# Altium schematic sheet AT long bus (13.3 x 4.2 inches).schdoc: AT long bus (13.3 x 4.2 inches)
size A; Organization: Organization; Address1: Address1; Address2: Address2; Address3: Address3; Address4: Address4; DocumentNumber: 1; Revision: 0; SheetNumber: 2; SheetTotal: 2
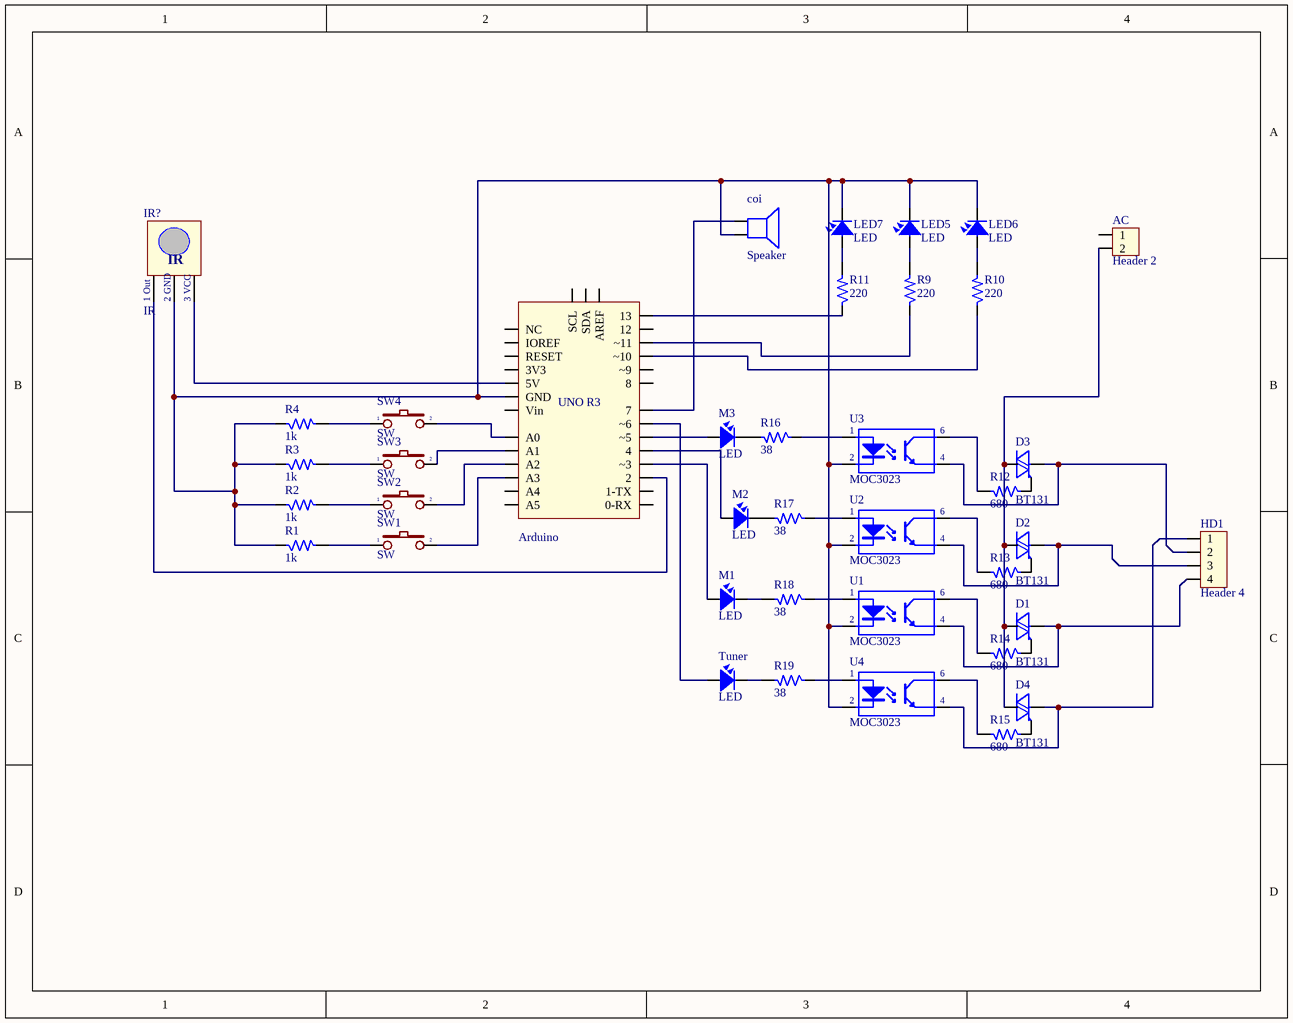
[diagram p0: AT long bus (13.3 x 4.2 inches).schdoc]

## Parts
AC  Header 2  [HED2]
Arduino  Arduino Uno R3  [Arduino UNO R3]  (value not drawn)
coi  Speaker  [SPEAKER]
D1  BT131  [TO92127P520H787-3]
D2  BT131  [TO92127P520H787-3]
D3  BT131  [TO92127P520H787-3]
D4  BT131  [TO92127P520H787-3]
HD1  Header 4  [HED4]
IR?  IR  [IR]
LED5  LED  [LED-5TRED]
LED6  LED  [LED-5TRED]
LED7  LED  [LED-5TRED]
M1  LED  [LED-5TRED]
M2  LED  [LED-5TRED]
M3  LED  [LED-5TRED]
R1  1k  [R1/8W]
R2  1k  [R1/8W]
R3  1k  [R1/8W]
R4  1k  [R1/8W]
R9  220  [R1/8W]
R10  220  [R1/8W]
R11  220  [R1/8W]
R12  680  [R1/8W]
R13  680  [R1/8W]
R14  680  [R1/8W]
R15  680  [R1/8W]
R16  38  [R1/8W]
R17  38  [R1/8W]
R18  38  [R1/8W]
R19  38  [R1/8W]
SW1  SW  [SW2]
SW2  SW  [SW2]
SW3  SW  [SW2]
SW4  SW  [SW2]
Tuner  LED  [LED-5TRED]
U1  MOC3023  [DIP6]
U2  MOC3023  [DIP6]
U3  MOC3023  [DIP6]
U4  MOC3023  [DIP6]

## Nets
NetAC_2: AC.2 D1.3(MT2) D2.3(MT2) D3.3(MT2) D4.3(MT2)
NetArduino_2: Arduino.2 IR?.1(Out)
NetArduino_4: Arduino.4 M2.1
NetArduino_5V: Arduino.5V IR?.3(VCC)
NetArduino_7: Arduino.7 coi.1
NetArduino_13: Arduino.13 R11.1
NetArduino_A0: Arduino.A0 SW4.2
NetArduino_A1: Arduino.A1 SW3.2
NetArduino_A2: Arduino.A2 SW2.2
NetArduino_A3: Arduino.A3 SW1.2
NetArduino_GND: Arduino.GND coi.2 IR?.2(GND) LED5.2 LED6.2 LED7.2 R1.1 R2.1 R3.1 R4.1 U1.2(K) U2.2(K) U3.2(K) U4.2(K)
NetArduino_~3: Arduino.~3 M1.1
NetArduino_~5: Arduino.~5 M3.1
NetArduino_~6: Arduino.~6 Tuner.1
NetArduino_~10: Arduino.~10 R10.1
NetArduino_~11: Arduino.~11 R9.1
NetD1_1: D1.1(MT1) HD1.4 U1.4(E)
NetD1_2: D1.2(G) R14.1
NetD2_1: D2.1(MT1) HD1.3 U2.4(E)
NetD2_2: D2.2(G) R13.1
NetD3_1: D3.1(MT1) HD1.2 U3.4(E)
NetD3_2: D3.2(G) R12.1
NetD4_1: D4.1(MT1) HD1.1 U4.4(E)
NetD4_2: D4.2(G) R15.1
NetLED5_1: LED5.1 R9.2
NetLED6_1: LED6.1 R10.2
NetLED7_1: LED7.1 R11.2
NetM1_2: M1.2 R18.2
NetM2_2: M2.2 R17.2
NetM3_2: M3.2 R16.2
NetR1_2: R1.2 SW1.1
NetR2_2: R2.2 SW2.1
NetR3_2: R3.2 SW3.1
NetR4_2: R4.2 SW4.1
NetR12_2: R12.2 U3.6(C)
NetR13_2: R13.2 U2.6(C)
NetR14_2: R14.2 U1.6(C)
NetR15_2: R15.2 U4.6(C)
NetR16_1: R16.1 U3.1(A)
NetR17_1: R17.1 U2.1(A)
NetR18_1: R18.1 U1.1(A)
NetR19_1: R19.1 U4.1(A)
NetR19_2: R19.2 Tuner.2

Not connected (* = marked no-connect by the designer): AC 1; Arduino 0-RX 1-TX 3V3 8 12 A4 A5 AREF IOREF NC RESET SCL SDA Vin ~9

## Notes on the sheet
- (in symbol Arduino Uno R3) UNO R3
- (in symbol IR) 1 Out; 2 GND; 3 VCC

## Library data of the parts
AC = Hed2: Header 2 (Green); Value: Header 2
Arduino = Arduino Uno R3: Value: Cau 1A
coi = Speaker: Loudspeaker; Published: 24-Mar-1999; LatestRevisionDate: 17-Jul-2002; LatestRevisionNote: Re-released for DXP Platform.; PackageReference: PIN2; Publisher: Altium Limited
D1-D4 = MAC97A8: TRIAC é‚è¼¯ - æ•æ„Ÿé–€ 600 V 600 mA é€šå­” TO-92 (TO-226); MF: ON Semiconductor; Check_prices: https://www.snapeda.com/parts/MAC97A8/Onsemi/view-part/?ref=eda; Price: None; SnapEDA_Link: https://www.snapeda.com/parts/MAC97A8/Onsemi/view-part/?ref=snap; Purchase-URL: https://pricing.snapeda.com/search/part/MAC97A8/?ref=eda; Value: *; MP: MAC97A8; Package: E-PKG AXIAL-LEADED-2 ON Semiconductor; Availability: In Stock
HD1 = Hed4: Header 4 (Green); Value: Header 4
IR? = IR: Receiver Infraed IC
LED5-LED7 M1-M3 Tuner = LED: LED Single colour Green and Red; Value: LED 3 ly Single Colour
R1-R4 R9-R19 = R: Resistor 1/4W; Value: R1/4W - 1K
SW1-SW4 = SW2: Switch button 2 pin; Value: SW chip 2 pin
U1-U4 = MOC3021: Single Opto; Value: MOC3021